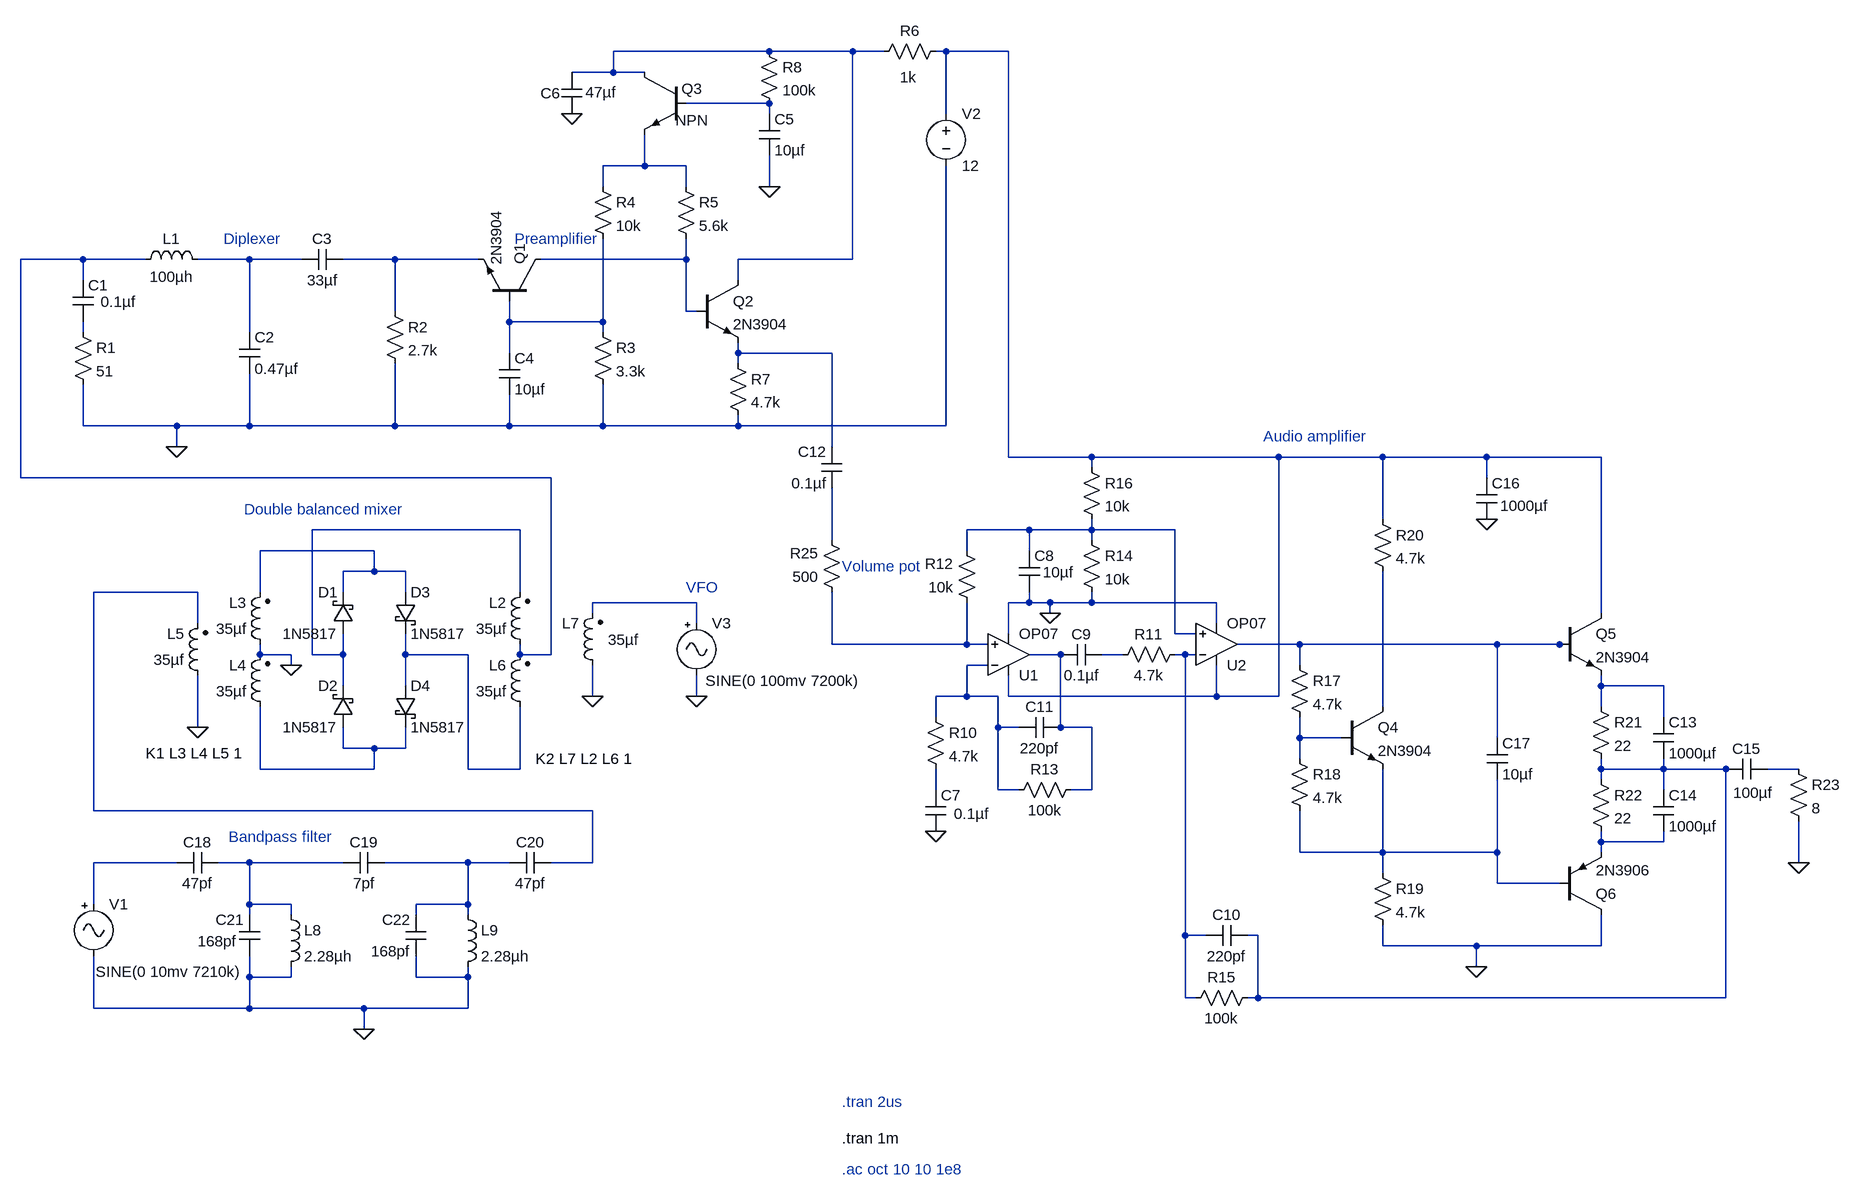
[diagram p0: schematic direct-conversion-receiver.asc]
direct-conversion-receiver.asc, the LTspice schematic file:
Version 4
SHEET 1 3300 1720
WIRE 1216 -16 976 -16
WIRE 1344 -16 1216 -16
WIRE 1392 -16 1344 -16
WIRE 1488 -16 1472 -16
WIRE 1584 -16 1488 -16
WIRE 976 16 976 -16
WIRE 976 16 912 16
WIRE 1024 16 976 16
WIRE 1216 64 1088 64
WIRE 1216 80 1216 64
WIRE 1488 80 1488 -16
WIRE 1024 160 1024 112
WIRE 1024 160 960 160
WIRE 1088 160 1024 160
WIRE 960 192 960 160
WIRE 1088 192 1088 160
WIRE 1216 192 1216 144
WIRE 160 304 64 304
WIRE 256 304 160 304
WIRE 416 304 336 304
WIRE 496 304 416 304
WIRE 640 304 560 304
WIRE 768 304 640 304
WIRE 1088 304 1088 272
WIRE 1088 304 864 304
WIRE 1344 304 1344 -16
WIRE 1344 304 1168 304
WIRE 160 336 160 304
WIRE 1168 336 1168 304
WIRE 640 384 640 304
WIRE 1088 384 1088 304
WIRE 1104 384 1088 384
WIRE 816 400 816 368
WIRE 960 400 960 272
WIRE 960 400 816 400
WIRE 160 416 160 400
WIRE 416 416 416 304
WIRE 960 416 960 400
WIRE 816 448 816 400
WIRE 1168 448 1168 432
WIRE 1312 448 1168 448
WIRE 1168 464 1168 448
WIRE 160 560 160 496
WIRE 304 560 160 560
WIRE 416 560 416 480
WIRE 416 560 304 560
WIRE 640 560 640 464
WIRE 640 560 416 560
WIRE 816 560 816 512
WIRE 816 560 640 560
WIRE 960 560 960 496
WIRE 960 560 816 560
WIRE 1168 560 1168 544
WIRE 1168 560 960 560
WIRE 1488 560 1488 160
WIRE 1488 560 1168 560
WIRE 304 592 304 560
WIRE 1312 592 1312 448
WIRE 1584 608 1584 -16
WIRE 1712 608 1584 608
WIRE 2000 608 1712 608
WIRE 2160 608 2000 608
WIRE 2320 608 2160 608
WIRE 2496 608 2320 608
WIRE 1712 624 1712 608
WIRE 64 640 64 304
WIRE 880 640 64 640
WIRE 2320 640 2320 608
WIRE 2160 704 2160 608
WIRE 832 720 512 720
WIRE 1616 720 1520 720
WIRE 1712 720 1712 704
WIRE 1712 720 1616 720
WIRE 1840 720 1712 720
WIRE 1312 736 1312 656
WIRE 1712 736 1712 720
WIRE 608 752 432 752
WIRE 1520 752 1520 720
WIRE 1616 752 1616 720
WIRE 608 784 608 752
WIRE 608 784 560 784
WIRE 656 784 608 784
WIRE 336 816 176 816
WIRE 432 816 432 752
WIRE 560 816 560 784
WIRE 656 816 656 784
WIRE 832 816 832 720
WIRE 1104 832 944 832
WIRE 1616 832 1616 816
WIRE 1616 832 1584 832
WIRE 1648 832 1616 832
WIRE 1712 832 1712 816
WIRE 1712 832 1648 832
WIRE 1904 832 1712 832
WIRE 944 848 944 832
WIRE 1648 848 1648 832
WIRE 2496 848 2496 608
WIRE 336 864 336 816
WIRE 1104 864 1104 832
WIRE 1904 864 1904 832
WIRE 1584 880 1584 832
WIRE 1840 880 1840 720
WIRE 1872 880 1840 880
WIRE 1312 896 1312 816
WIRE 1520 896 1520 832
WIRE 1520 896 1312 896
WIRE 1552 896 1520 896
WIRE 2032 896 1936 896
WIRE 2336 896 2032 896
WIRE 2432 896 2336 896
WIRE 2448 896 2432 896
WIRE 432 912 432 896
WIRE 480 912 432 912
WIRE 512 912 512 720
WIRE 560 912 560 880
WIRE 560 912 512 912
WIRE 656 912 656 880
WIRE 752 912 656 912
WIRE 832 912 832 896
WIRE 880 912 880 640
WIRE 880 912 832 912
WIRE 1664 912 1616 912
WIRE 1760 912 1728 912
WIRE 1856 912 1840 912
WIRE 1872 912 1856 912
WIRE 480 928 480 912
WIRE 1552 928 1520 928
WIRE 2032 928 2032 896
WIRE 560 960 560 912
WIRE 656 960 656 912
WIRE 2496 960 2496 944
WIRE 2592 960 2496 960
WIRE 944 976 944 928
WIRE 1104 976 1104 944
WIRE 1520 976 1520 928
WIRE 1520 976 1472 976
WIRE 1568 976 1520 976
WIRE 1584 976 1584 944
WIRE 1904 976 1904 928
WIRE 1904 976 1584 976
WIRE 2000 976 2000 608
WIRE 2000 976 1904 976
WIRE 2160 992 2160 784
WIRE 2496 992 2496 960
WIRE 1472 1008 1472 976
WIRE 2592 1008 2592 960
WIRE 336 1024 336 944
WIRE 1568 1024 1568 976
WIRE 1600 1024 1568 1024
WIRE 1664 1024 1664 912
WIRE 1712 1024 1664 1024
WIRE 2032 1040 2032 1008
WIRE 2096 1040 2032 1040
WIRE 2336 1040 2336 896
WIRE 560 1056 560 1024
WIRE 608 1056 560 1056
WIRE 656 1056 656 1024
WIRE 656 1056 608 1056
WIRE 2032 1072 2032 1040
WIRE 432 1088 432 992
WIRE 608 1088 608 1056
WIRE 608 1088 432 1088
WIRE 752 1088 752 912
WIRE 832 1088 832 992
WIRE 832 1088 752 1088
WIRE 2496 1088 2496 1072
WIRE 2592 1088 2592 1072
WIRE 2592 1088 2496 1088
WIRE 2688 1088 2592 1088
WIRE 2800 1088 2752 1088
WIRE 2496 1104 2496 1088
WIRE 1472 1120 1472 1088
WIRE 1568 1120 1568 1024
WIRE 1600 1120 1568 1120
WIRE 1712 1120 1712 1024
WIRE 1712 1120 1680 1120
WIRE 2592 1120 2592 1088
WIRE 176 1152 176 816
WIRE 944 1152 176 1152
WIRE 2496 1200 2496 1184
WIRE 2592 1200 2592 1184
WIRE 2592 1200 2496 1200
WIRE 2032 1216 2032 1152
WIRE 2160 1216 2160 1088
WIRE 2160 1216 2032 1216
WIRE 2336 1216 2336 1104
WIRE 2336 1216 2160 1216
WIRE 2496 1216 2496 1200
WIRE 304 1232 176 1232
WIRE 416 1232 368 1232
WIRE 560 1232 416 1232
WIRE 752 1232 624 1232
WIRE 816 1232 752 1232
WIRE 944 1232 944 1152
WIRE 944 1232 880 1232
WIRE 2800 1232 2800 1168
WIRE 2160 1248 2160 1216
WIRE 2336 1264 2336 1216
WIRE 2432 1264 2336 1264
WIRE 176 1296 176 1232
WIRE 416 1296 416 1232
WIRE 480 1296 416 1296
WIRE 752 1296 752 1232
WIRE 752 1296 672 1296
WIRE 416 1312 416 1296
WIRE 480 1312 480 1296
WIRE 672 1312 672 1296
WIRE 752 1312 752 1296
WIRE 1856 1344 1856 912
WIRE 1888 1344 1856 1344
WIRE 1968 1344 1952 1344
WIRE 2160 1360 2160 1328
WIRE 2304 1360 2160 1360
WIRE 2496 1360 2496 1312
WIRE 2496 1360 2304 1360
WIRE 2304 1392 2304 1360
WIRE 416 1408 416 1376
WIRE 480 1408 480 1392
WIRE 480 1408 416 1408
WIRE 672 1408 672 1376
WIRE 752 1408 752 1392
WIRE 752 1408 672 1408
WIRE 1856 1440 1856 1344
WIRE 1872 1440 1856 1440
WIRE 1968 1440 1968 1344
WIRE 1968 1440 1952 1440
WIRE 2688 1440 2688 1088
WIRE 2688 1440 1968 1440
WIRE 176 1456 176 1376
WIRE 416 1456 416 1408
WIRE 416 1456 176 1456
WIRE 592 1456 416 1456
WIRE 752 1456 752 1408
WIRE 752 1456 592 1456
WIRE 592 1488 592 1456
FLAG 304 592 0
FLAG 1216 192 0
FLAG 912 80 0
FLAG 1648 848 0
FLAG 1472 1184 0
FLAG 2304 1392 0
FLAG 2320 704 0
FLAG 2800 1232 0
FLAG 336 1024 0
FLAG 480 928 0
FLAG 944 976 0
FLAG 592 1488 0
FLAG 1104 976 0
SYMBOL ind 240 320 R270
WINDOW 0 32 56 VTop 2
WINDOW 3 5 56 VBottom 2
SYMATTR InstName L1
SYMATTR Value 100µh
SYMBOL res 144 400 R0
SYMATTR InstName R1
SYMATTR Value 51
SYMBOL cap 144 336 R0
WINDOW 3 43 33 Left 2
SYMATTR Value 0.1µf
SYMATTR InstName C1
SYMBOL cap 400 416 R0
SYMATTR InstName C2
SYMATTR Value 0.47µf
SYMBOL cap 560 288 R90
WINDOW 0 0 32 VBottom 2
WINDOW 3 32 32 VTop 2
SYMATTR InstName C3
SYMATTR Value 33µf
SYMBOL Misc/signal 176 1280 R0
WINDOW 3 3 120 Left 2
SYMATTR Value SINE(0 10mv 7210k)
SYMATTR InstName V1
SYMATTR Value2 AC 1 0
SYMATTR SpiceLine Rser=50
SYMBOL npn 864 368 M270
SYMATTR InstName Q1
SYMATTR Value 2N3904
SYMBOL res 624 368 R0
SYMATTR InstName R2
SYMATTR Value 2.7k
SYMBOL cap 800 448 R0
SYMATTR InstName C4
SYMATTR Value 10µf
SYMBOL res 944 400 R0
SYMATTR InstName R3
SYMATTR Value 3.3k
SYMBOL res 944 176 R0
SYMATTR InstName R4
SYMATTR Value 10k
SYMBOL res 1072 176 R0
SYMATTR InstName R5
SYMATTR Value 5.6k
SYMBOL voltage 1488 64 R0
SYMATTR InstName V2
SYMATTR Value 12
SYMBOL npn 1104 336 R0
SYMATTR InstName Q2
SYMATTR Value 2N3904
SYMBOL res 1152 448 R0
SYMATTR InstName R7
SYMATTR Value 4.7k
SYMBOL res 1376 0 R270
WINDOW 0 32 56 VTop 2
WINDOW 3 -8 54 VBottom 2
SYMATTR InstName R6
SYMATTR Value 1k
SYMBOL npn 1088 16 M0
WINDOW 0 -25 25 Left 2
WINDOW 3 -34 74 Left 2
SYMATTR InstName Q3
SYMBOL res 1200 -32 R0
SYMATTR InstName R8
SYMATTR Value 100k
SYMBOL cap 1200 80 R0
SYMATTR InstName C5
SYMATTR Value 10µf
SYMBOL cap 896 16 R0
WINDOW 0 -32 32 Left 2
WINDOW 3 37 31 Left 2
SYMATTR InstName C6
SYMATTR Value 47µf
SYMBOL OpAmps/OP07 1584 976 M180
SYMATTR InstName U1
SYMBOL OpAmps/OP07 1904 960 M180
SYMATTR InstName U2
SYMBOL res 1456 992 R0
SYMATTR InstName R10
SYMATTR Value 4.7k
SYMBOL res 1856 896 R90
WINDOW 0 0 56 VBottom 2
WINDOW 3 32 56 VTop 2
SYMATTR InstName R11
SYMATTR Value 4.7k
SYMBOL res 1536 848 R180
WINDOW 0 36 76 Left 2
WINDOW 3 36 40 Left 2
SYMATTR InstName R12
SYMATTR Value 10k
SYMBOL cap 1456 1120 R0
WINDOW 3 44 37 Left 2
SYMATTR Value 0.1µf
SYMATTR InstName C7
SYMBOL cap 1600 752 R0
WINDOW 3 37 33 Left 2
SYMATTR Value 10µf
SYMATTR InstName C8
SYMBOL cap 1728 896 R90
WINDOW 0 0 32 VBottom 2
WINDOW 3 32 32 VTop 2
SYMATTR InstName C9
SYMATTR Value 0.1µf
SYMBOL cap 1952 1328 R90
WINDOW 0 0 32 VBottom 2
WINDOW 3 32 32 VTop 2
SYMATTR InstName C10
SYMATTR Value 220pf
SYMBOL cap 1664 1008 R90
WINDOW 0 0 32 VBottom 2
WINDOW 3 32 32 VTop 2
SYMATTR InstName C11
SYMATTR Value 220pf
SYMBOL res 1696 1104 R90
WINDOW 0 0 56 VBottom 2
WINDOW 3 32 56 VTop 2
SYMATTR InstName R13
SYMATTR Value 100k
SYMBOL cap 1328 656 R180
WINDOW 0 24 56 Left 2
WINDOW 3 24 8 Left 2
SYMATTR InstName C12
SYMATTR Value 0.1µf
SYMBOL res 1696 720 R0
SYMATTR InstName R14
SYMATTR Value 10k
SYMBOL res 1968 1424 R90
WINDOW 0 0 56 VBottom 2
WINDOW 3 32 56 VTop 2
SYMATTR InstName R15
SYMATTR Value 100k
SYMBOL res 1696 608 R0
SYMATTR InstName R16
SYMATTR Value 10k
SYMBOL npn 2096 992 R0
SYMATTR InstName Q4
SYMATTR Value 2N3904
SYMBOL npn 2432 848 R0
SYMATTR InstName Q5
SYMATTR Value 2N3904
SYMBOL pnp 2432 1312 M180
SYMATTR InstName Q6
SYMATTR Value 2N3906
SYMBOL res 2016 912 R0
SYMATTR InstName R17
SYMATTR Value 4.7k
SYMBOL res 2016 1056 R0
SYMATTR InstName R18
SYMATTR Value 4.7k
SYMBOL res 2144 1232 R0
SYMATTR InstName R19
SYMATTR Value 4.7k
SYMBOL res 2144 688 R0
SYMATTR InstName R20
SYMATTR Value 4.7k
SYMBOL res 2480 976 R0
SYMATTR InstName R21
SYMATTR Value 22
SYMBOL res 2480 1088 R0
SYMATTR InstName R22
SYMATTR Value 22
SYMBOL cap 2576 1008 R0
SYMATTR InstName C13
SYMATTR Value 1000µf
SYMBOL cap 2576 1120 R0
SYMATTR InstName C14
SYMATTR Value 1000µf
SYMBOL cap 2752 1072 R90
WINDOW 0 0 32 VBottom 2
WINDOW 3 37 22 VTop 2
SYMATTR InstName C15
SYMATTR Value 100µf
SYMBOL cap 2304 640 R0
WINDOW 3 37 43 Left 2
SYMATTR Value 1000µf
SYMATTR InstName C16
SYMBOL cap 2320 1040 R0
SYMATTR InstName C17
SYMATTR Value 10µf
SYMBOL res 2784 1072 R0
SYMATTR InstName R23
SYMATTR Value 8
SYMBOL res 1328 832 R180
WINDOW 0 36 76 Left 2
WINDOW 3 36 40 Left 2
SYMATTR InstName R25
SYMATTR Value 500
SYMBOL ind2 448 912 R180
WINDOW 0 36 80 Left 2
WINDOW 3 36 40 Left 2
SYMATTR InstName L3
SYMATTR Value 35µf
SYMATTR Type ind
SYMBOL ind2 448 1008 R180
WINDOW 0 36 80 Left 2
WINDOW 3 36 40 Left 2
SYMATTR InstName L4
SYMATTR Value 35µf
SYMATTR Type ind
SYMBOL ind2 352 960 R180
WINDOW 0 36 80 Left 2
WINDOW 3 36 40 Left 2
SYMATTR InstName L5
SYMATTR Value 35µf
SYMATTR Type ind
SYMBOL schottky 576 880 R180
WINDOW 0 24 64 Left 2
WINDOW 3 24 0 Left 2
SYMATTR InstName D1
SYMATTR Value 1N5817
SYMATTR Description Diode
SYMATTR Type diode
SYMBOL schottky 576 1024 R180
WINDOW 0 24 64 Left 2
WINDOW 3 24 0 Left 2
SYMATTR InstName D2
SYMATTR Value 1N5817
SYMATTR Description Diode
SYMATTR Type diode
SYMBOL schottky 640 816 R0
SYMATTR InstName D3
SYMATTR Value 1N5817
SYMATTR Description Diode
SYMATTR Type diode
SYMBOL schottky 640 960 R0
SYMATTR InstName D4
SYMATTR Value 1N5817
SYMATTR Description Diode
SYMATTR Type diode
SYMBOL ind2 848 912 R180
WINDOW 0 36 80 Left 2
WINDOW 3 36 40 Left 2
SYMATTR InstName L2
SYMATTR Value 35µf
SYMATTR Type ind
SYMBOL ind2 848 1008 R180
WINDOW 0 36 80 Left 2
WINDOW 3 36 40 Left 2
SYMATTR InstName L6
SYMATTR Value 35µf
SYMATTR Type ind
SYMBOL ind2 960 944 R180
WINDOW 0 36 80 Left 2
WINDOW 3 -55 55 Left 2
SYMATTR InstName L7
SYMATTR Value 35µf
SYMATTR Type ind
SYMBOL Misc/signal 1104 848 R0
WINDOW 3 14 104 Left 2
SYMATTR Value SINE(0 100mv 7200k)
SYMATTR InstName V3
SYMATTR Value2 AC 1 0
SYMATTR SpiceLine Rser=50
SYMBOL cap 368 1216 R90
WINDOW 0 0 32 VBottom 2
WINDOW 3 32 32 VTop 2
SYMATTR InstName C18
SYMATTR Value 47pf
SYMBOL cap 624 1216 R90
WINDOW 0 0 32 VBottom 2
WINDOW 3 32 32 VTop 2
SYMATTR InstName C19
SYMATTR Value 7pf
SYMBOL cap 880 1216 R90
WINDOW 0 0 32 VBottom 2
WINDOW 3 32 32 VTop 2
SYMATTR InstName C20
SYMATTR Value 47pf
SYMBOL cap 432 1376 R180
WINDOW 0 24 56 Left 2
WINDOW 3 35 23 Left 2
SYMATTR InstName C21
SYMATTR Value 168pf
SYMBOL cap 688 1376 R180
WINDOW 0 24 56 Left 2
WINDOW 3 24 8 Left 2
SYMATTR InstName C22
SYMATTR Value 168pf
SYMBOL ind 464 1296 R0
SYMATTR InstName L8
SYMATTR Value 2.28µh
SYMBOL ind 736 1296 R0
SYMATTR InstName L9
SYMATTR Value 2.28µh
TEXT 1328 1704 Left 2 ;.ac oct 10 10 1e8
TEXT 1328 1656 Left 2 !.tran 1m
TEXT 1328 1600 Left 2 ;.tran 2us
TEXT 256 1064 Left 2 !K1 L3 L4 L5 1
TEXT 856 1072 Left 2 !K2 L7 L2 L6 1
TEXT 384 1192 Left 2 ;Bandpass filter
TEXT 408 688 Left 2 ;Double balanced mixer
TEXT 376 272 Left 2 ;Diplexer
TEXT 824 272 Left 2 ;Preamplifier
TEXT 1976 576 Left 2 ;Audio amplifier
TEXT 1088 808 Left 2 ;VFO
TEXT 1328 776 Left 2 ;Volume pot

The netlist it stands for:
* direct-conversion-receiver.asc
L1 N005 N006 100µh
R1 N010 0 51
C1 N005 N010 0.1µf
C2 N006 0 0.47µf
C3 N007 N006 33µf
V1 N034 0 SINE(0 10mv 7210k) AC 1 0 Rser=50
Q1 N008 N009 N007 0 2N3904
R2 N007 0 2.7k
C4 N009 0 10µf
R3 N009 0 3.3k
R4 N004 N009 10k
R5 N004 N008 5.6k
V2 N002 0 12
Q2 N001 N008 N011 0 2N3904
R7 N011 0 4.7k
R6 N001 N002 1k
Q3 N001 N003 N004 0 NPN
R8 N001 N003 100k
C5 N003 0 10µf
C6 N001 0 47µf
XU1 N018 N024 N002 0 N021 LT1001  ; OP07, pins In+ In- V+ V- OUT
XU2 N013 N023 N002 0 N019 LT1001  ; OP07, pins In+ In- V+ V- OUT
R10 N024 N031 4.7k
R11 N023 N022 4.7k
R12 N018 N013 10k
C7 N031 0 0.1µf
C8 N013 0 10µf
C9 N022 N021 0.1µf
C10 N029 N023 220pf
C11 N021 N024 220pf
R13 N021 N024 100k
C12 N014 N011 0.1µf
R14 N013 0 10k
R15 N029 N023 100k
R16 N002 N013 10k
Q4 N026 N027 N033 0 2N3904
Q5 N002 N019 N025 0 2N3904
Q6 0 N033 N032 0 2N3906
R17 N019 N027 4.7k
R18 N027 N033 4.7k
R19 N033 0 4.7k
R20 N002 N026 4.7k
R21 N025 N029 22
R22 N029 N032 22
C13 N025 N029 1000µf
C14 N029 N032 1000µf
C15 N030 N029 100µf
C16 N002 0 1000µf
C17 N019 N033 10µf
R23 N030 0 8
R25 N018 N014 500
L3 0 N015 35µf
L4 N028 0 35µf
L5 0 N016 35µf
D1 N012 N015 1N5817
D2 N028 N012 1N5817
D3 N015 N020 1N5817
D4 N020 N028 1N5817
L2 N005 N012 35µf
L6 N020 N005 35µf
L7 0 N017 35µf
V3 N017 0 SINE(0 100mv 7200k) AC 1 0 Rser=50
C18 N035 N034 47pf
C19 N036 N035 7pf
C20 N016 N036 47pf
C21 0 N035 168pf
C22 0 N036 168pf
L8 N035 0 2.28µh
L9 N036 0 2.28µh
.model D D
.lib standard.dio
.model NPN NPN
.model PNP PNP
.lib standard.bjt
* .ac oct 10 10 1e8
.tran 1m
* .tran 2us
K1 L3 L4 L5 1
K2 L7 L2 L6 1
* Bandpass filter
* Double balanced mixer
* Diplexer
* Preamplifier
* Audio amplifier
* VFO
* Volume pot
.lib LTC.lib
.backanno
.end